# EAGLE design photodiode (EAGLE 6.4)
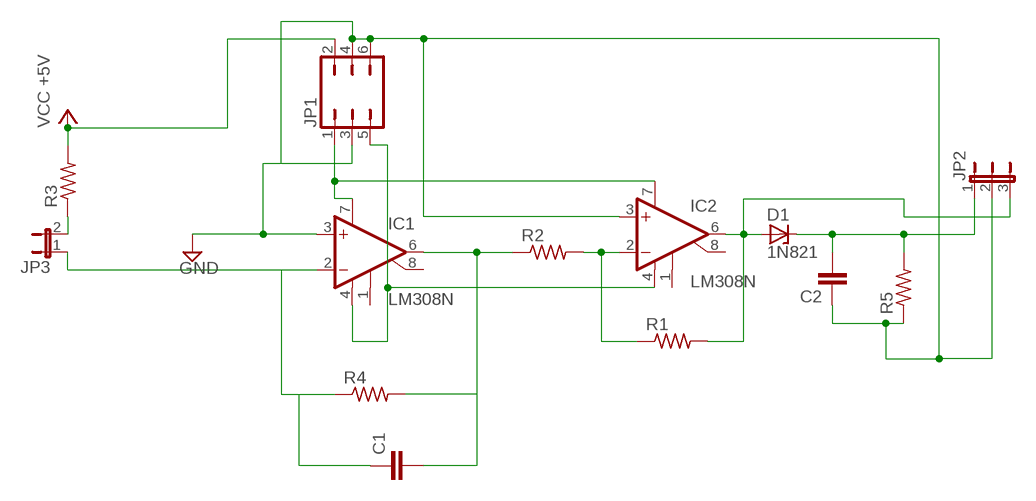
[diagram p0: schematic, sheet 1]

## Parts
C1  C-EU025-024X044  [C025-024X044]
C2  C-EU025-024X044  [C025-024X044]
D1  1N821  [DO35Z10]
IC1  LM308N  [DIL08]
IC2  LM308N  [DIL08]
JP1  JP3Q  [JP3Q]
JP2  JP2E  [JP2]
JP3  JP1E  [JP1]
R1  R-US_0207/10  [0207/10]
R2  R-US_0207/10  [0207/10]
R3  R-US_0207/10  [0207/10]
R4  R-US_0207/10  [0207/10]
R5  R-US_0207/10  [0207/10]

## Nets
GND: C2.1 IC1.3(+IN) IC2.3(+IN) JP1.3 JP1.4 JP1.6 JP2.2 R5.1
N$1: JP3.2 R3.1
N$2: C1.1 IC1.2(-IN) JP3.1 R4.1
N$3: C1.2 IC1.6(OUT) R2.1 R4.2
N$4: IC1.7(V+) IC2.7(V+) JP1.1
N$5: D1.A IC2.6(OUT) JP2.3 R1.2
N$6: IC1.4(V-) IC2.4(V-) JP1.5
N$7: C2.2 D1.C JP2.1 R5.2
N$9: IC2.2(-IN) R1.1 R2.2
VCC: JP1.2 R3.2 ; supply symbol labelled VCC +5V
Unconnected: IC1.1(CMP1) IC1.8(CMP2) IC2.1(CMP1) IC2.8(CMP2)

## Library data of the parts
C1 C2 = resistor:C-EU: CAPACITOR, European symbol
D1 = diode:1N821: Reference DIODE temperature compensated, 6,2 V
IC1 IC2 = linear:LM308: OP AMP
JP1 = jumper:JP3Q: JUMPER
JP2 = jumper:JP2E: JUMPER
JP3 = jumper:JP1E: JUMPER
R1-R5 = resistor:R-US_: RESISTOR, American symbol

## Board
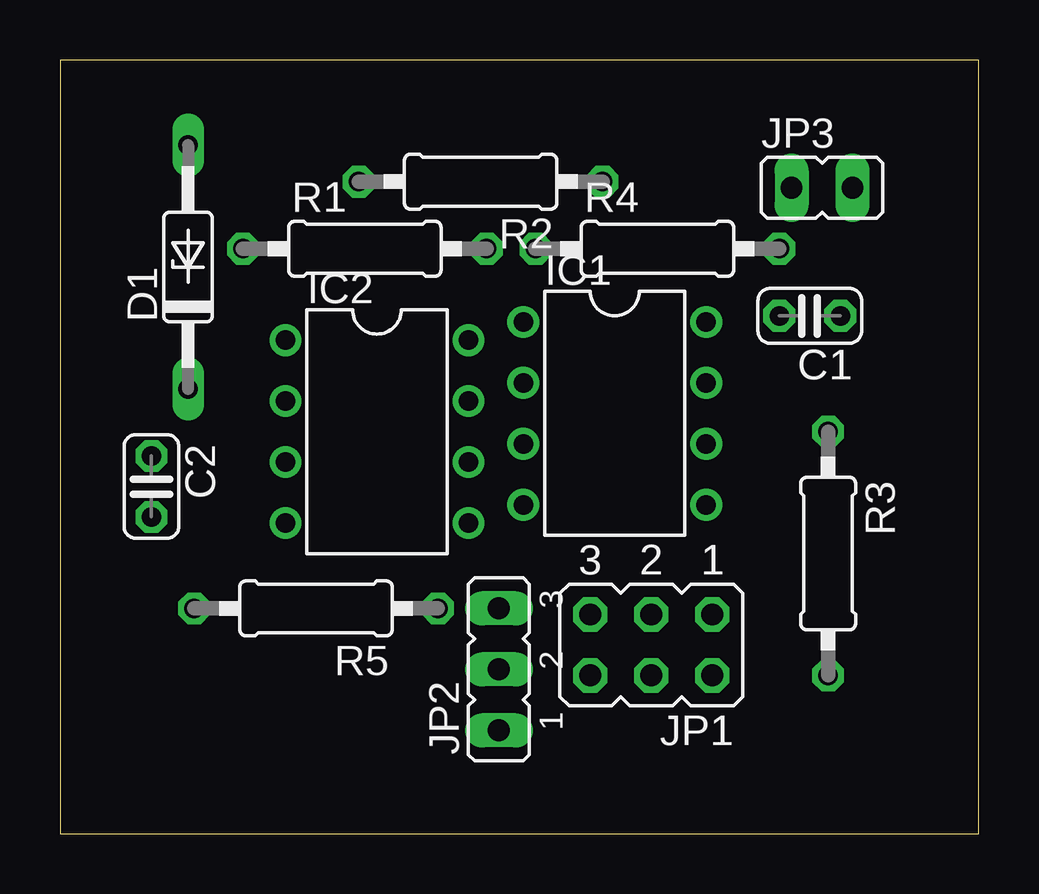
[diagram p1: board, top side]
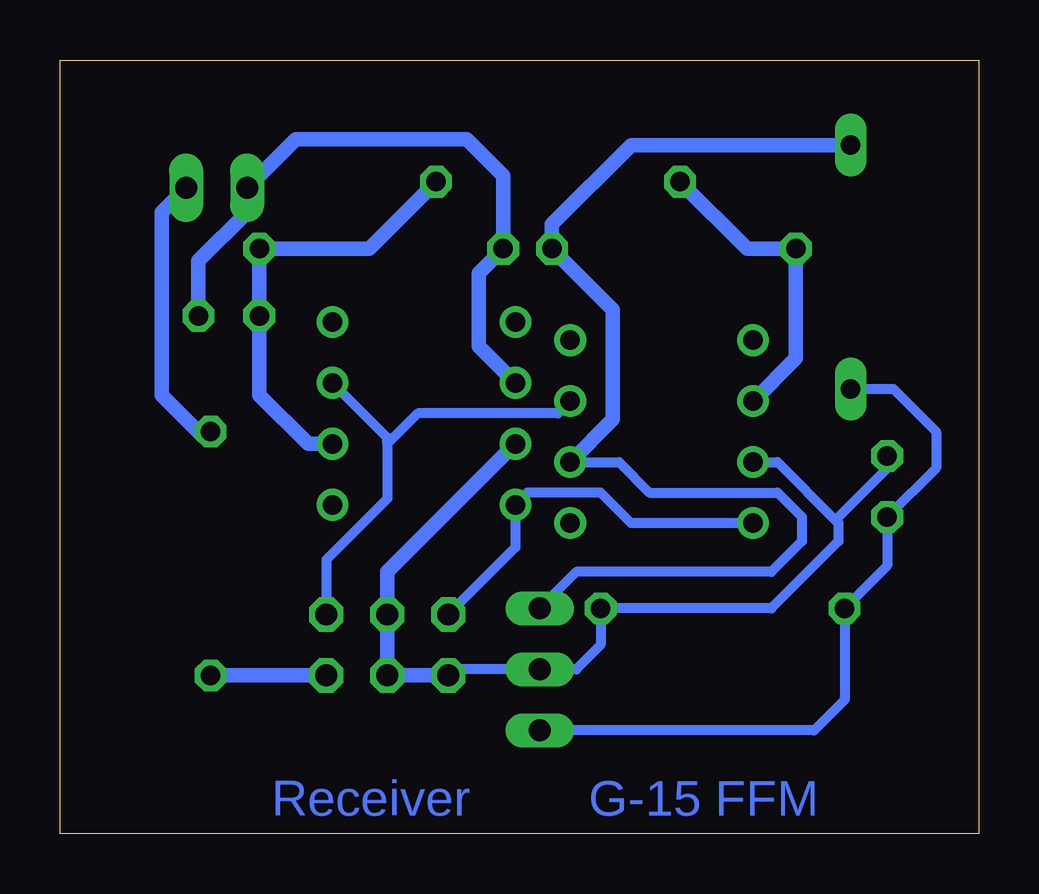
[diagram p2: board, bottom side, seen from below]

Size 38.28 x 32.25 mm. Coordinates in mm from the lower left corner, seen from the top.
Outline: 0,0 38.28,0 38.28,32.25 0,32.25 0,0
Copper layers (1*16): Top 0.035mm / dielectric 1.5mm / Bottom 0.035mm
Design rules "default *": minimum track width 16mil, minimum drill 30mil, track to track 16mil, track to pad 16mil, pad to pad 16mil, via to via 16mil, smd to smd 16mil, copper to edge 40mil, drill to drill 8mil, minimum pad ring 10mil, minimum via ring 8mil, stop-mask expansion 4mil, vias tented up to drill 0mil, thermal gap 10mil

### Footprints (pad centres in the part's own frame; a part is rotated, then mirrored left to right if it is on the bottom)
C025-024X044 = drill 0.813 octagon: 1 -1.27,0; 2 1.27,0
DO35Z10 = drill 0.813 long: A 5.08,0; C -5.08,0
DIL08 = drill 0.813 pad 1.27: 1 -3.81,-3.81; 2 -1.27,-3.81; 3 1.27,-3.81; 4 3.81,-3.81; 5 3.81,3.81; 6 1.27,3.81; 7 -1.27,3.81; 8 -3.81,3.81
JP3Q = drill 0.914 octagon: 1 -2.54,-1.27; 2 -2.54,1.27; 3 0,-1.27; 4 0,1.27; 5 2.54,-1.27; 6 2.54,1.27
JP2 = drill 0.914 long: 1 -2.54,0; 2 0,0; 3 2.54,0
JP1 = drill 0.914 long: 1 0,-1.27; 2 0,1.27
0207/10 = drill 0.813 octagon: 1 -5.08,0; 2 5.08,0

### Placement (x,y rotation side)
C1  31.24,21.59 180 top
C2  3.81,14.48 270 top
D1  5.33,23.62 90 top
IC1  23.11,17.53 270 top
IC2  13.21,16.76 270 top
JP1  24.64,7.87 180 top
JP2  18.29,6.86 90 top
JP3  31.75,26.92 270 top
R1  12.7,24.38 0 top
R2  17.53,27.18 180 top
R3  32,11.68 270 top
R4  24.89,24.38 0 top
R5  10.67,9.4 180 top

### Tracks (layer width: path | path; a pad name or v marks a point on that pad's centre or on a via)
GND
  Bottom 0.406: JP1.6 21.84,6.86 JP2.2 16.76,6.86 15.75,7.87 R5.1 8.64,9.4 5.84,12.19 5.84,12.95 5.97,13.08 | IC2.3 8.38,15.49 5.97,13.08 | C2.1 3.81,15.24 5.97,13.08
  Bottom 0.61: JP1.6 JP1.4 JP1.3 24.64,10.92 IC1.3
N$1
  Bottom 0.61: R3.1 32.51,16.76 34.04,18.29 34.04,25.91 JP3.2
N$2
  Bottom 0.61: IC1.2 20.83,20.32 20.83,23.37 R4.1 19.81,27.43 21.34,28.96 28.45,28.96 JP3.1 30.48,25.91 32.51,23.88 C1.1
N$3
  Bottom 0.61: R2.1 25.4,24.38 R4.2 C1.2 29.97,18.29 27.94,16.26 IC1.6
N$4
  Bottom 0.406: IC2.7 17.53,17.53 23.37,17.53 24.64,16.26 | 24.64,16.26 24.64,13.97 27.18,11.43 JP1.1 | 24.64,16.26 24.64,16.51 IC1.7
N$5
  Bottom 0.406: IC2.6 14.99,15.49 13.72,14.22 8.38,14.22 7.37,13.21 7.37,12.19 8.64,10.92 16.76,10.92 JP2.3
  Bottom 0.61: D1.A 14.48,28.7 17.78,25.4 R1.2 15.24,21.84 15.24,17.27 IC2.6
N$6
  Bottom 0.406: JP1.5 19.3,11.94 IC1.4 18.8,14.22 15.75,14.22 14.48,12.95 IC2.4
N$7
  Bottom 0.406: D1.C 3.56,18.54 1.78,16.76 1.78,15.24 C2.2 3.81,11.18 R5.2 5.59,5.59 6.86,4.32 JP2.1
N$9
  Bottom 0.61: R2.2 9.65,24.38 R1.1 7.62,19.81 IC2.2
VCC
  Bottom 0.61: JP1.2 R3.2

### Text on the board
Bottom: G-15 FFM | Receiver